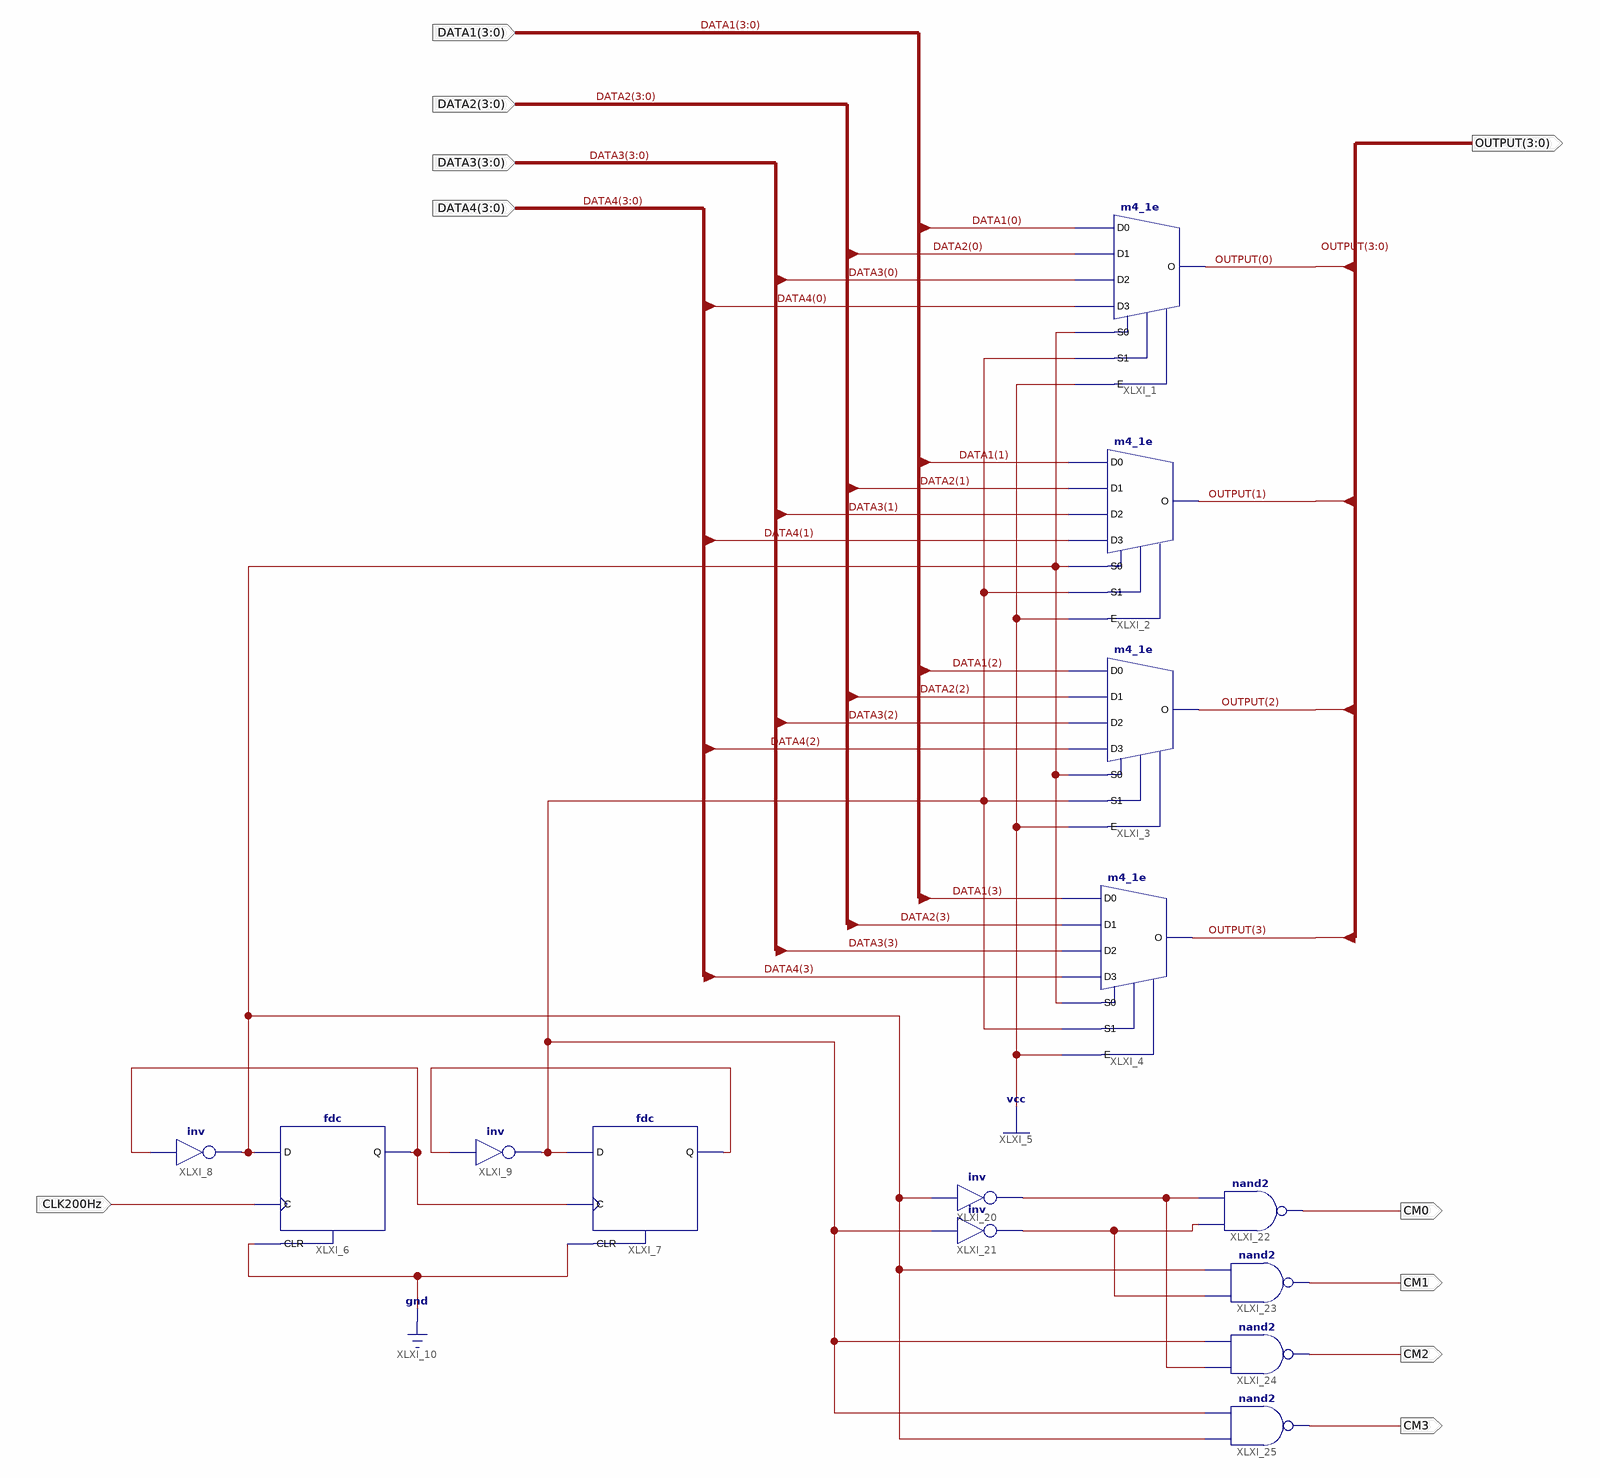
[diagram p0: schematic sheet 1]
// Xilinx ISE schematic MUX4_TO_1.sch (spartan6) as structural Verilog: 14 symbols, 10 ports
module MUX4_TO_1 (
  input  [3:0] DATA1,
  input  [3:0] DATA2,
  input  [3:0] DATA3,
  input  [3:0] DATA4,
  input  CLK200Hz,
  output [3:0] OUTPUT,
  output CM0,
  output CM1,
  output CM3,
  output CM2
);

  wire XLXN_34, XLXN_36, XLXN_46, XLXN_88, XLXN_90, XLXN_95;

  m4_1e XLXI_1 (
    .D0(DATA1[0]), .D1(DATA2[0]), .D2(DATA3[0]), .D3(DATA4[0]), .E(1'b1), .S0(XLXN_46), .S1(XLXN_95),
    .O(OUTPUT[0]));
  m4_1e XLXI_2 (
    .D0(DATA1[1]), .D1(DATA2[1]), .D2(DATA3[1]), .D3(DATA4[1]), .E(1'b1), .S0(XLXN_46), .S1(XLXN_95),
    .O(OUTPUT[1]));
  m4_1e XLXI_3 (
    .D0(DATA1[2]), .D1(DATA2[2]), .D2(DATA3[2]), .D3(DATA4[2]), .E(1'b1), .S0(XLXN_46), .S1(XLXN_95),
    .O(OUTPUT[2]));
  m4_1e XLXI_4 (
    .D0(DATA1[3]), .D1(DATA2[3]), .D2(DATA3[3]), .D3(DATA4[3]), .E(1'b1), .S0(XLXN_46), .S1(XLXN_95),
    .O(OUTPUT[3]));
  fdc XLXI_6 (.C(CLK200Hz), .CLR(1'b0), .D(XLXN_46), .Q(XLXN_34));
  fdc XLXI_7 (.C(XLXN_34), .CLR(1'b0), .D(XLXN_95), .Q(XLXN_36));
  not XLXI_8 (XLXN_46, XLXN_34);
  not XLXI_9 (XLXN_95, XLXN_36);
  not XLXI_20 (XLXN_88, XLXN_46);
  not XLXI_21 (XLXN_90, XLXN_95);
  nand XLXI_22 (CM0, XLXN_90, XLXN_88);
  nand XLXI_23 (CM1, XLXN_90, XLXN_46);
  nand XLXI_24 (CM2, XLXN_88, XLXN_95);
  nand XLXI_25 (CM3, XLXN_46, XLXN_95);
endmodule
